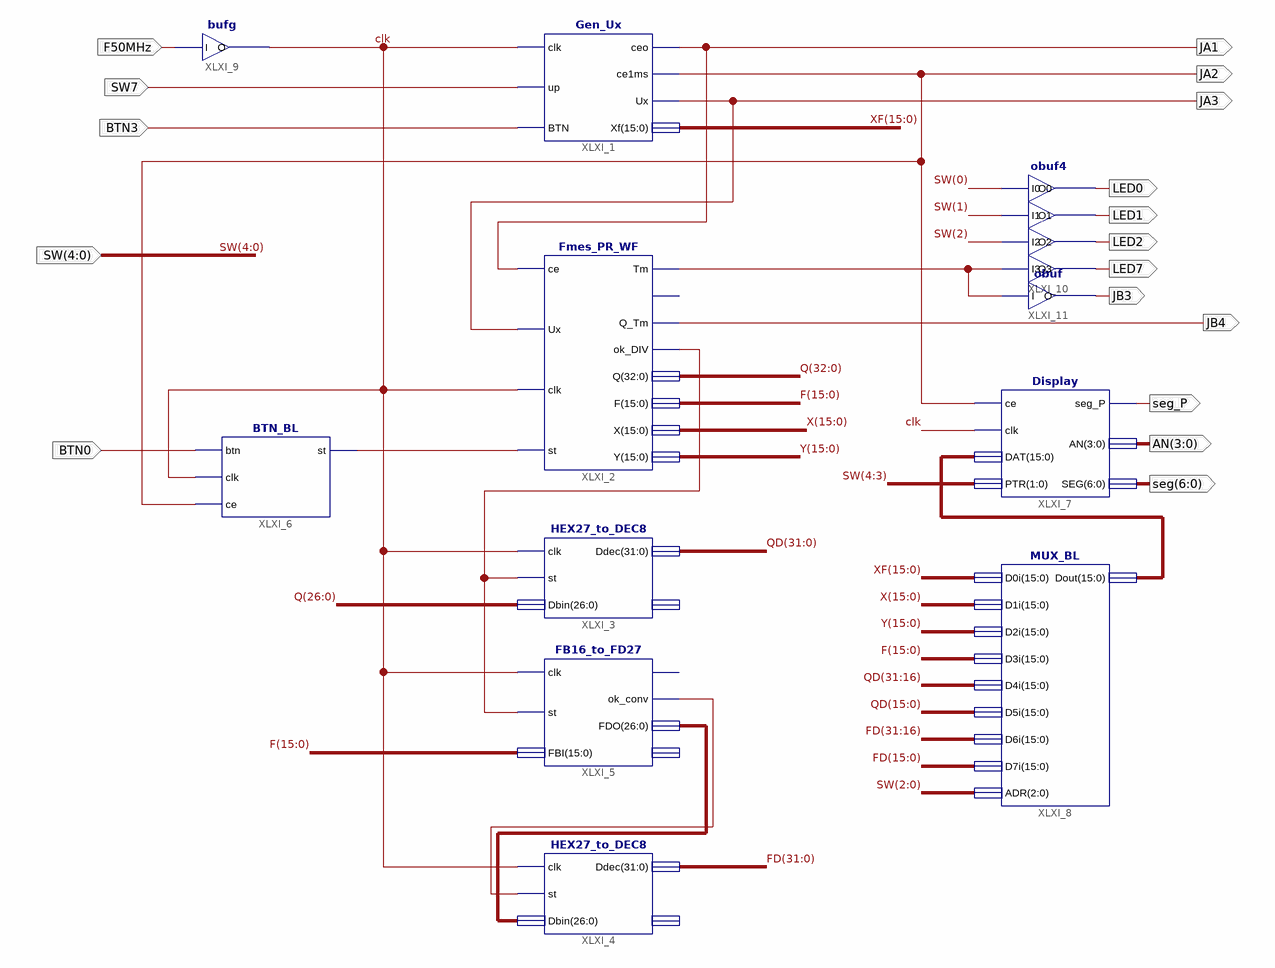
[diagram p0: schematic sheet 1]
// Xilinx ISE schematic Sch_Lab403.sch (spartan3e) as structural Verilog: 11 symbols, 17 ports
module Sch_Lab403 (
  input  F50MHz,
  input  BTN0,
  input  SW7,
  input  BTN3,
  input  [4:0] SW,
  output JB4,
  output JA1,
  output JA3,
  output JA2,
  output LED0,
  output LED1,
  output LED2,
  output LED7,
  output JB3,
  output seg_P,
  output [3:0] AN,
  output [6:0] seg
);

  wire clk, XLXN_7, XLXN_17, XLXN_26, XLXN_28;
  wire [15:0] F, X, XF, XLXN_47, Y;
  wire [26:0] XLXN_29;
  wire [31:0] FD, QD;
  wire [32:0] Q;

  Gen_Ux XLXI_1 (.clk(clk), .up(SW7), .BTN(BTN3), .ceo(JA1), .ce1ms(JA2), .Ux(JA3), .Xf(XF));
  Fmes_PR_WF XLXI_2 (
    .ce(JA1), .Ux(JA3), .clk(clk), .st(XLXN_7), .Tm(XLXN_17), .Q_Tm(JB4), .ok_DIV(XLXN_26), .Q(Q), .F(F),
    .X(X), .Y(Y));  // open: ce_end
  HEX27_to_DEC8 XLXI_3 (.clk(clk), .st(XLXN_26), .Dbin(Q[26:0]), .Ddec(QD));  // open: ptr_dig
  HEX27_to_DEC8 XLXI_4 (.clk(clk), .st(XLXN_28), .Dbin(XLXN_29), .Ddec(FD));  // open: ptr_dig
  FB16_to_FD27 XLXI_5 (.clk(clk), .st(XLXN_26), .FBI(F), .ok_conv(XLXN_28), .FDO(XLXN_29));  // open: EN_conv, cb_tact
  BTN_BL XLXI_6 (.btn(BTN0), .clk(clk), .ce(JA2), .st(XLXN_7));
  Display XLXI_7 (.ce(JA2), .clk(clk), .DAT(XLXN_47), .PTR(SW[4:3]), .seg_P(seg_P), .AN(AN), .SEG(seg));
  MUX_BL XLXI_8 (
    .D0i(XF), .D1i(X), .D2i(Y), .D3i(F), .D4i(QD[31:16]), .D5i(QD[15:0]), .D6i(FD[31:16]), .D7i(FD[15:0]),
    .ADR(SW[2:0]), .Dout(XLXN_47));
  bufg XLXI_9 (.I(F50MHz), .O(clk));
  obuf4 XLXI_10 (.I0(SW[0]), .I1(SW[1]), .I2(SW[2]), .I3(XLXN_17), .O0(LED0), .O1(LED1), .O2(LED2), .O3(LED7));
  obuf XLXI_11 (.I(XLXN_17), .O(JB3));
endmodule
